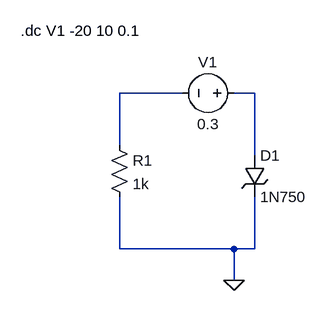
[diagram p0: schematic Draft2.asc]
Draft2.asc, the LTspice schematic file:
Version 4
SHEET 1 880 680
WIRE 80 48 -16 48
WIRE 192 48 160 48
WIRE -16 128 -16 48
WIRE 192 144 192 48
WIRE -16 288 -16 208
WIRE 160 288 -16 288
WIRE 192 288 192 208
WIRE 192 288 160 288
WIRE 160 336 160 288
FLAG 160 336 0
SYMBOL voltage 176 48 R90
WINDOW 0 -32 56 VBottom 2
WINDOW 3 32 56 VTop 2
WINDOW 123 0 0 Left 0
WINDOW 39 0 0 Left 0
SYMATTR InstName V1
SYMATTR Value 0.3
SYMBOL res -32 112 R0
SYMATTR InstName R1
SYMATTR Value 1k
SYMBOL zener 176 144 R0
SYMATTR InstName D1
SYMATTR Value 1N750
TEXT -168 -48 Left 2 !.dc V1 -20 10 0.1

The netlist it stands for:
* Draft2.asc
V1 N002 N001 0.3
R1 N001 0 1k
D1 N002 0 1N750
.model D D
.lib standard.dio
.dc V1 -20 10 0.1
.backanno
.end